# EAGLE design 5v-3v3-converter (EAGLE 7.2.0)
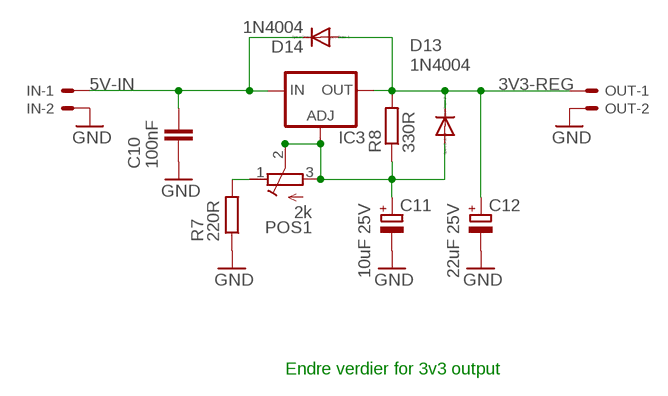
[diagram p0: schematic, sheet 1]

## Parts
C10  100nF  C-EU050-025X075  [C050-025X075]
C11  10uF 25V  CPOL-EUE2.5-5  [E2,5-5]
C12  22uF 25V  CPOL-EUE2.5-5  [E2,5-5]
D13  1N4004  [DO41-10]
D14  1N4004  [DO41-10]
IC3  LM317TS  [317TS]
IN  KK-156-2  [KK-156-2]
OUT  KK-156-2  [KK-156-2]
POS1  2k  R-TRIMMT93YA  [RTRIMT93YA]
R7  220R  R-EU_0207/7  [0207/7]
R8  330R  R-EU_0207/7  [0207/7]

## Nets
3V3-REG: C12.+ D13.C D14.A IC3.2(OUT) OUT.1 R8.2
5V-IN: C10.1 D14.C IC3.3(IN) IN.1
GND: C10.2 C11.- C12.- IN.2 OUT.2 R7.1
N$3: POS1.1(E) R7.2
N$5: C11.+ D13.A IC3.1(ADJ) POS1.2(S) POS1.3(A) R8.1

## Notes on the sheet
- Endre verdier for 3v3 output

## Library data of the parts
C10 = resistor:C-EU: CAPACITOR, European symbol
C11 C12 = resistor:CPOL-EU: POLARIZED CAPACITOR, European symbol
D13 D14 = diode:1N4004: DIODE general purpose rectifier, 1 A
IC3 = v-reg:LM317TS: VOLTAGE REGULATOR
IN OUT = con-molex:KK-156-2: KK 156 HEADER Source: http://www.molex.com/pdm_docs/sd/026604100_sd.pdf; OC_FARNELL: unknown; OC_NEWARK: unknown
POS1 = resistor:R-TRIMM: Trimm resistor
R7 R8 = resistor:R-EU_: RESISTOR, European symbol

## Board
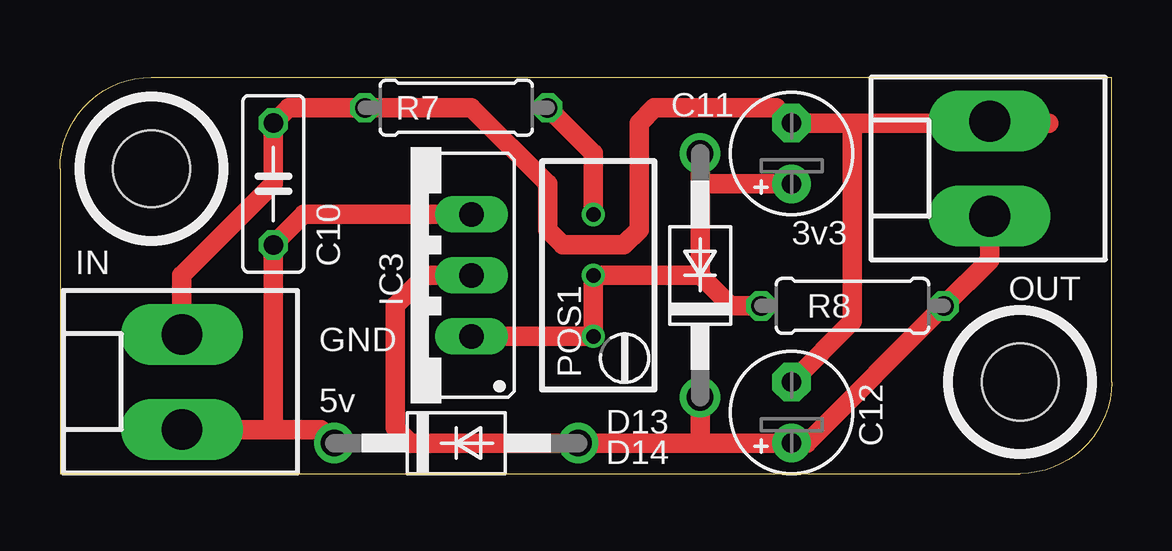
[diagram p1: board, top side]

Size 43.81 x 16.51 mm. Coordinates in mm from the lower left corner, seen from the top.
Outline: 3.81,16.5 43.81,16.5 43.81,3.81 arc-90 40.01,0 0,0 0,12.7 arc-90 3.81,16.51
Copper layers (1*16): Top 0.0356mm / dielectric 1.5011mm / Bottom 0.0356mm
Design rules "LaenPCBOrder": minimum track width 6mil, minimum drill 13mil, track to track 6mil, track to pad 6mil, pad to pad 6mil, via to via 6mil, smd to smd 6mil, copper to edge 15mil, drill to drill 6mil, minimum pad ring 7mil, minimum via ring 7mil, stop-mask expansion 3mil, vias tented up to drill 0mil, thermal gap 10mil
Holes 3.2 mm at 3.81,12.7 40.01,3.81

### Footprints (pad centres in the part's own frame; a part is rotated, then mirrored left to right if it is on the bottom)
C050-025X075 = drill 0.813 octagon: 1 -2.54,0; 2 2.54,0
E2,5-5 = drill 0.813 pad 1.6: + -1.27,0 | drill 0.813 pad 1.6 octagon: - 1.27,0
DO41-10 = drill 1.118: A 5.08,0; C -5.08,0
317TS = drill 1.016 long: 1 -2.54,-2.54; 2 0,-2.54; 3 2.54,-2.54
KK-156-2 = drill 1.7 pad 2.184 long: 1 -1.98,0; 2 1.98,0
RTRIMT93YA = drill 0.61: 1 0,-2.54; 2 0,0; 3 0,2.54
0207/7 = drill 0.813 octagon: 1 -3.81,0; 2 3.81,0

### Placement (x,y rotation side)
C10  8.89,12.06 90 top
C11  30.48,13.34 90 top
C12  30.48,2.54 90 top
D13  26.67,8.26 90 top
D14  16.51,1.27 0 top
IC3  14.61,8.26 90 top
IN  5.08,3.81 90 top
OUT  38.73,12.7 90 top
POS1  22.23,8.26 180 top
R7  16.51,15.24 0 top
R8  33.02,6.99 0 top

### Tracks (layer width: path | path; a pad name or v marks a point on that pad's centre or on a via)
3V3-REG
  Top 0.813: IC3.2 15.24,8.26 13.97,6.99 13.97,1.91 14.61,1.27 D14.A 26.67,1.27 | 26.67,1.27 C12.+ 31.11,1.27 R8.2 38.73,8.89 OUT.1 | D13.C 26.67,1.27
5V-IN
  Top 0.813: IN.1 8.89,1.83 | 8.89,1.83 C10.1 10.16,10.79 IC3.3 | 8.89,1.83 10.87,1.83 D14.C
GND
  Top 0.813: IN.2 5.08,8.26 8.89,12.06 C10.2 9.53,15.24 R7.1 17.14,15.24 20.32,12.06 20.32,10.16 20.95,9.53 23.5,9.53 24.13,10.16 24.13,14.61 24.77,15.24 29.84,15.24 C11.- 33.02,14.61 | 33.02,14.61 41.2,14.61 OUT.2 | C12.- 33.02,6.35 33.02,14.61
N$3
  Top 0.813: R7.2 22.23,13.34 POS1.1
N$5
  Top 0.813: IC3.1 POS1.3 POS1.2 26.67,8.26 | 26.67,8.26 26.67,12.06 | 26.67,12.06 D13.A | 26.67,12.06 C11.+ | R8.1 27.94,6.99 26.67,8.26

### Text on the board
tPlace: 3v3 | GND | 5v